# EAGLE design powerctl (EAGLE 7.7.0)
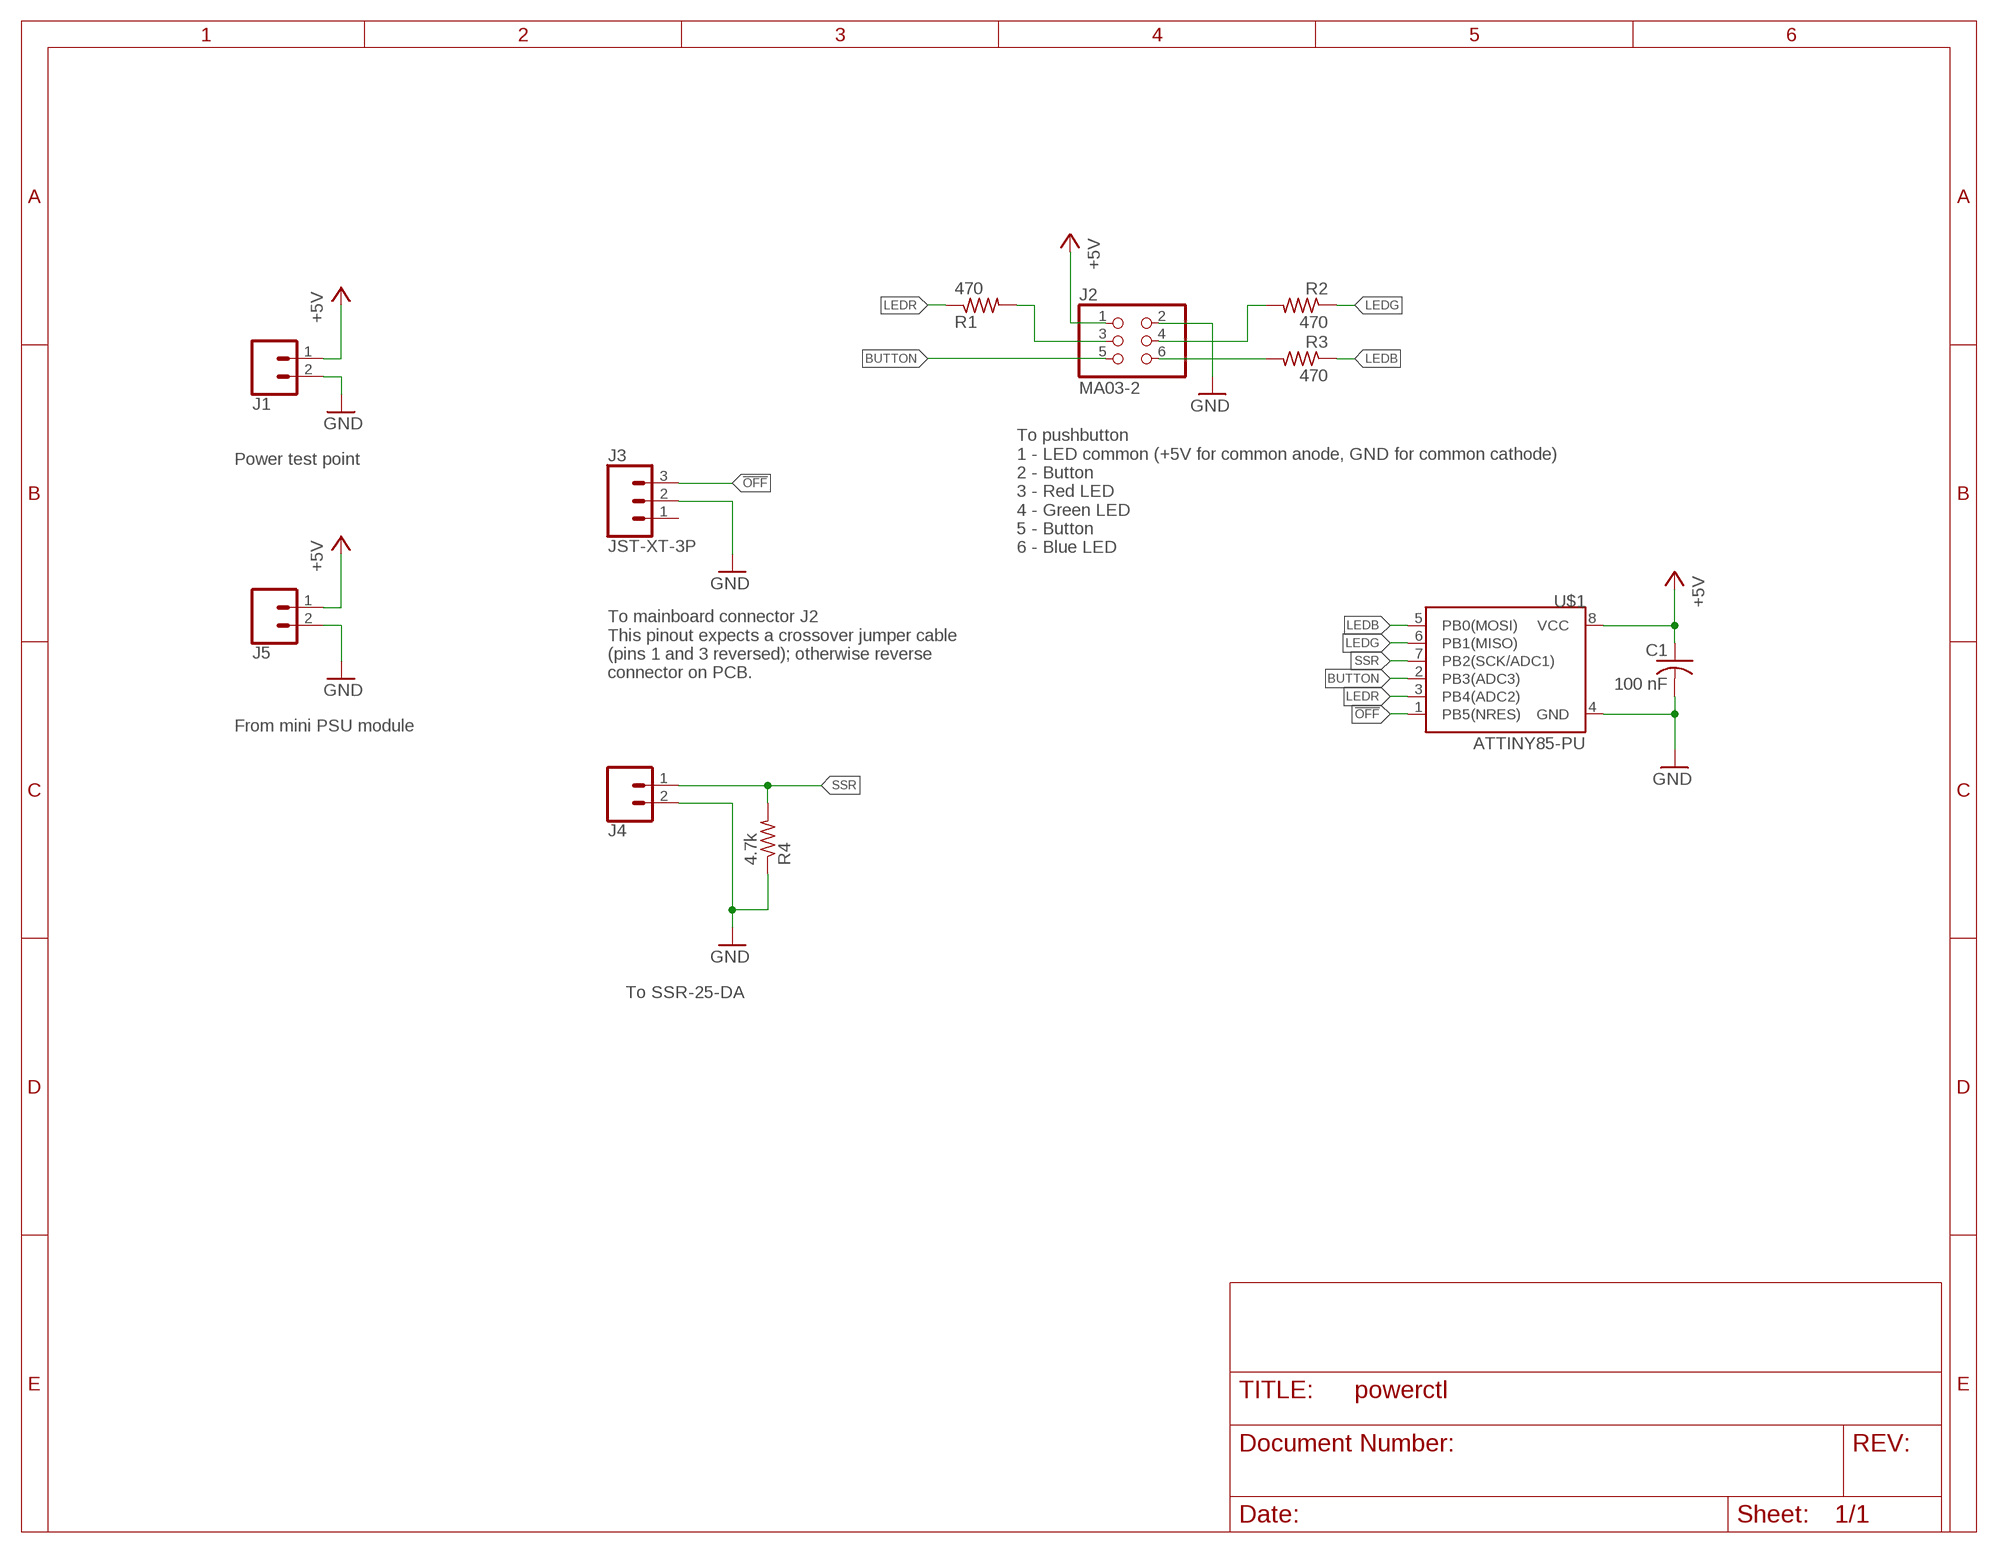
[diagram p0: schematic, sheet 1]

## Parts
C1  100 nF  C-US025-025X050  [C025-025X050]
J1  CONN_02  [1X02]
J2  MA03-2  PINHD-2X3  [2X03]
J3  JST-XT-3P  CONN_03  [1X03]
J4  CONN_02  [1X02]
J5  CONN_02  [1X02]
R1  470  R-US_0207/15  [0207/15]
R2  470  R-US_0207/15  [0207/15]
R3  470  R-US_0207/15  [0207/15]
R4  4.7k  R-US_0207/15  [0207/15]
U$1  ATTINY85-PU  ATTINY13DIP  [DIP08]

## Nets
!OFF: J3.3 U$1.1(PB5(NRES))
+5V [supply]: C1.1 J1.1 J2.1 J5.1 U$1.8(VCC)
BUTTON: J2.5 U$1.2(PB3(ADC3))
GND [supply]: C1.2 J1.2 J2.2 J3.2 J4.2 J5.2 R4.1 U$1.4(GND)
LEDB: R3.1 U$1.5(PB0(MOSI))
LEDG: R2.1 U$1.6(PB1(MISO))
LEDR: R1.1 U$1.3(PB4(ADC2))
N$1: J2.6 R3.2
N$2: J2.3 R1.2
N$3: J2.4 R2.2
SSR [supply]: J4.1 R4.2 U$1.7(PB2(SCK/ADC1))
Unconnected: J3.1

## Notes on the sheet
- Power test point
- To pushbutton
  1 - LED common (+5V for common anode, GND for common cathode)
  2 - Button
  3 - Red LED
  4 - Green LED
  5 - Button
  6 - Blue LED
- To mainboard connector J2
  This pinout expects a crossover jumper cable
  (pins 1 and 3 reversed); otherwise reverse
  connector on PCB.
- From mini PSU module
- To SSR-25-DA

## Library data of the parts
C1 = rcl:C-US: CAPACITOR, American symbol
J1 J4 J5 = SparkFun-Connectors:CONN_02: Multi connection point. Often used as Generic Header-pin footprint for 0.1 inch spaced/style header connections On any of the 0.1 inch spaced packages, you can populate with these: Break Away Headers - Straight <https://www.sparkfun.com/products/116> (PRT-00116) Break Away Male Headers - Right Angle <https://www.sparkfun.com/products/553> (PRT-00553) Female Headers <https://www.sparkfun.com/products/115> (PRT-00115) Break Away Headers - Machine Pin <https://www.sparkfun.com/products/117> (PRT-00117) Break Away Female Headers - Swiss Machine Pin <https://www.sparkfun.com/products/743> (PRT-00743) For SCREWTERMINALS and SPRING TERMINALS visit here: Screw Terimnals on SparkFun.com <https://www.sparkfun.com/search/results?term=Screw+Terminals> (5mm/3.5mm/2.54mm spacing) This device is also useful as a general connection point to wire up your design to another part of your project. Our various solder wires solder well into these plated through hole pads. Hook-Up Wire - Assortment (Stranded, 22 AWG) <https://www.sparkfun.com/products/11375> (PRT-11375) Hook-Up Wire - Assortment (Solid Core, 22 AWG) <https://www.sparkfun.com/products/11367> (PRT-11367) View the entire wire category on our website here <https://www.sparkfun.com/categories/141> Special notes: Molex polarized connector foot print use with: PRT-08233 with associated crimp pins and housings. 2.54_SCREWTERM for use with PRT-10571. 3.5mm Screw Terminal footprints for PRT-08084 5mm Screw Terminal footprints for use with PRT-08432
J2 = pinhead:PINHD-2X3: PIN HEADER
J3 = SparkFun-Connectors:CONN_03: Multi connection point. Often used as Generic Header-pin footprint for 0.1 inch spaced/style header connections On any of the 0.1 inch spaced packages, you can populate with these: Break Away Headers - Straight <https://www.sparkfun.com/products/116> (PRT-00116) Break Away Male Headers - Right Angle <https://www.sparkfun.com/products/553> (PRT-00553) Female Headers <https://www.sparkfun.com/products/115> (PRT-00115) Break Away Headers - Machine Pin <https://www.sparkfun.com/products/117> (PRT-00117) Break Away Female Headers - Swiss Machine Pin <https://www.sparkfun.com/products/743> (PRT-00743) Stackable Header - 3 Pin (Female, 0.1") <https://www.sparkfun.com/products/13875> (PRT-13875) For SCREWTERMINALS and SPRING TERMINALS visit here: Screw Terimnals on SparkFun.com <https://www.sparkfun.com/search/results?term=Screw+Terminals> (5mm/3.5mm/2.54mm spacing) This device is also useful as a general connection point to wire up your design to another part of your project. Our various solder wires solder well into these plated through hole pads. Hook-Up Wire - Assortment (Stranded, 22 AWG) <https://www.sparkfun.com/products/11375> (PRT-11375) Hook-Up Wire - Assortment (Solid Core, 22 AWG) <https://www.sparkfun.com/products/11367> (PRT-11367) View the entire wire category on our website here <https://www.sparkfun.com/categories/141> Special notes: Molex polarized connector foot print use with SKU : PRT-08232 with associated crimp pins and housings.; PROD_ID: XXX-00000; VALUE: 455-1750-1-ND
R1-R4 = rcl:R-US_: RESISTOR, American symbol
U$1 = SparkFun:ATTINY13

## Net classes
0 default: width 0.381 mm
1 supply: width 0.762 mm

## Board
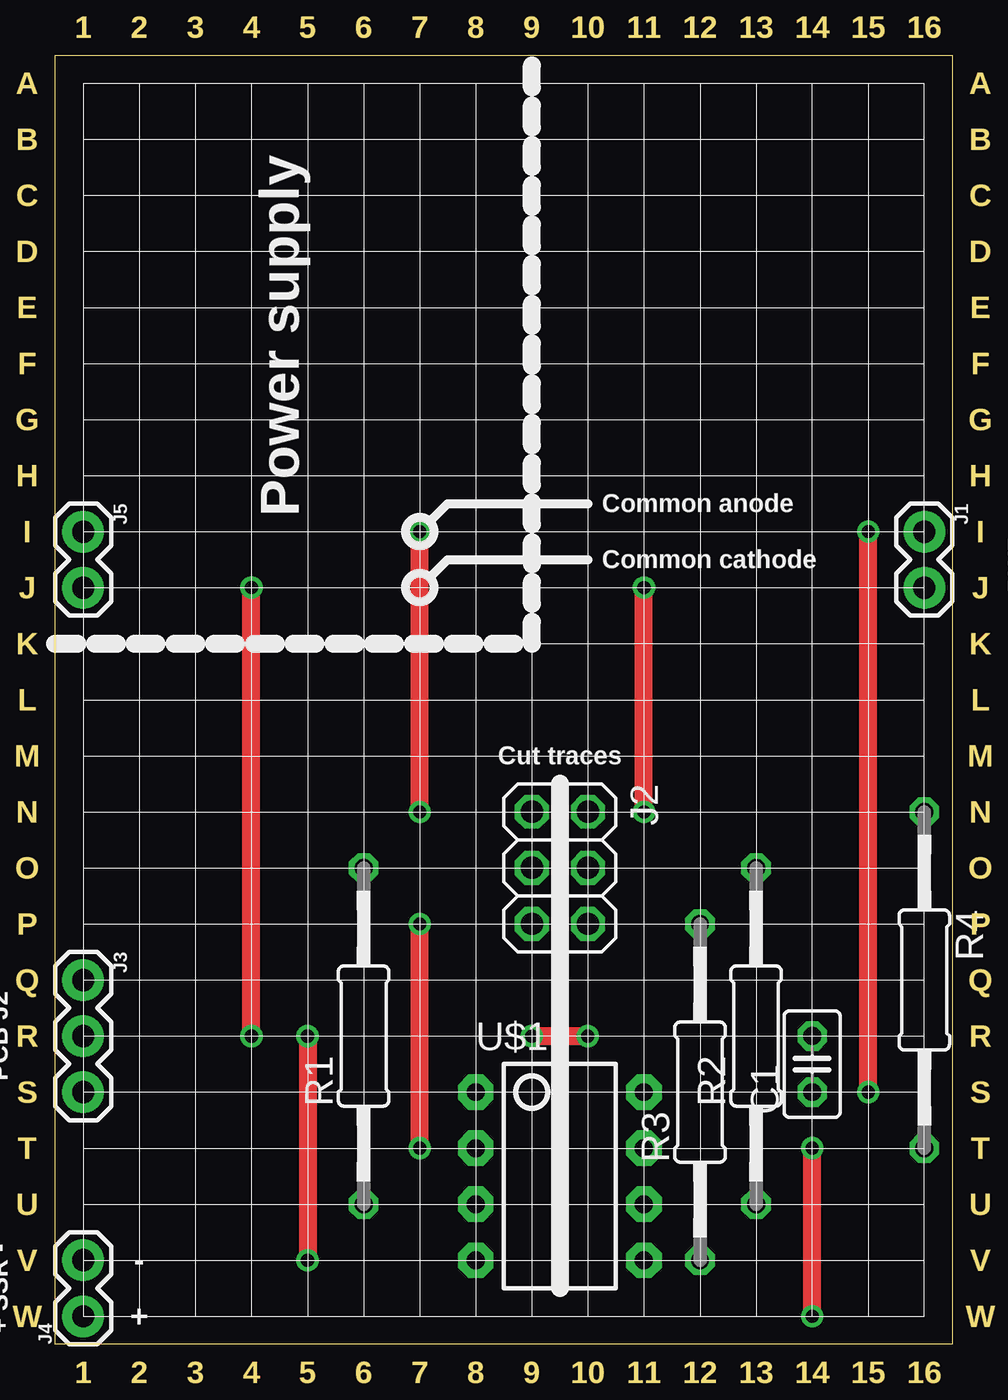
[diagram p1: board, top side]
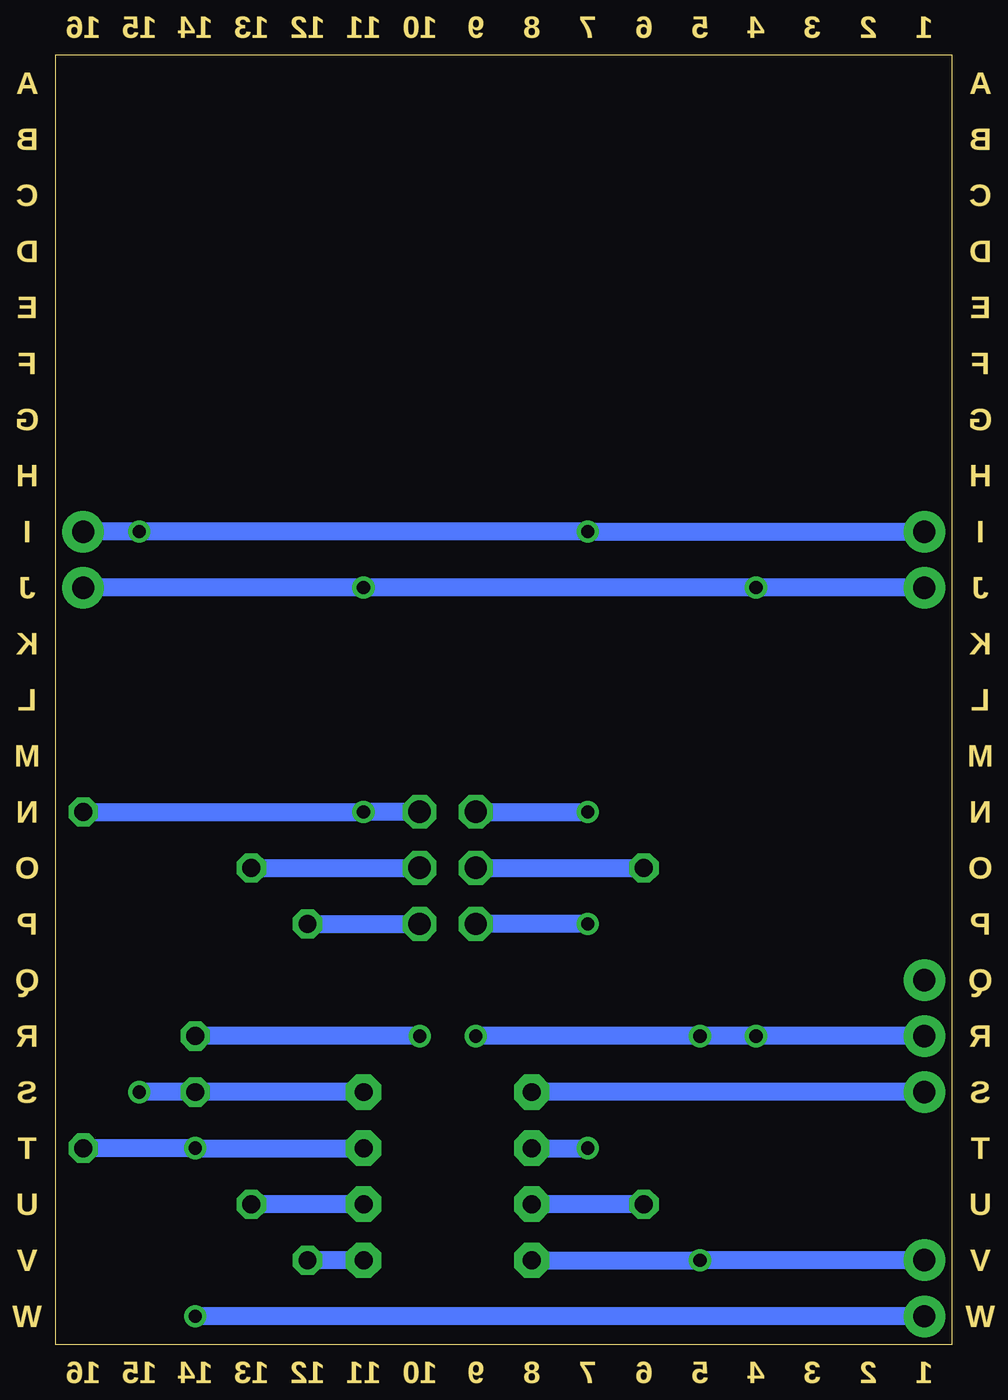
[diagram p2: board, bottom side, seen from below]

Size 40.64 x 58.42 mm. Coordinates in mm from the lower left corner, seen from the top.
Outline: 0,0 0,58.42 40.64,58.42 40.64,0 0,0
Copper layers (1*16): Top 0.035mm / dielectric 1.5mm / Bottom 0.035mm
Design rules "default": minimum track width 10mil, minimum drill 24mil, track to track 8mil, track to pad 8mil, pad to pad 8mil, via to via 8mil, smd to smd 8mil, copper to edge 40mil, drill to drill 8mil, minimum pad ring 10mil, minimum via ring 8mil, stop-mask expansion 4mil, vias tented up to drill 0mil, thermal gap 10mil
bKeepout: 1 lines

### Footprints (pad centres in the part's own frame; a part is rotated, then mirrored left to right if it is on the bottom)
C025-025X050 = drill 0.813 octagon: 1 -1.27,0; 2 1.27,0
1X02 = drill 1.016 pad 1.88: 1 0,0; 2 2.54,0
2X03 = drill 1.016 octagon: 1 -2.54,-1.27; 2 -2.54,1.27; 3 0,-1.27; 4 0,1.27; 5 2.54,-1.27; 6 2.54,1.27
1X03 = drill 1.016 pad 1.88: 1 0,0; 2 2.54,0; 3 5.08,0
0207/15 = drill 0.813 octagon: 1 -7.62,0; 2 7.62,0
DIP08 = drill 0.813 pad 1.6 octagon: 1 -3.81,-3.81; 2 -1.27,-3.81; 3 1.27,-3.81; 4 3.81,-3.81; 5 3.81,3.81; 6 1.27,3.81; 7 -1.27,3.81; 8 -3.81,3.81

### Placement (x,y rotation side)
C1  34.29,12.7 90 top
J1  39.37,36.83 270 top
J2  22.86,21.59 270 top
J3  1.27,16.51 270 top
J4  1.27,1.27 90 top
J5  1.27,36.83 270 top
R1  13.97,13.97 90 top
R2  31.75,13.97 90 top
R3  29.21,11.43 90 top
R4  39.37,16.51 270 top
U$1  22.86,7.62 270 top

### Tracks (layer width: path | path; a pad name or v marks a point on that pad's centre or on a via)
!OFF
  Bottom 0.813: J3.3 U$1.1
+5V  (via drill 0.6)
  Top 0.813: v16.51,24.13 v16.51,36.83 | v36.83,11.43 v36.83,36.83
  Bottom 0.813: C1.1 U$1.8 v36.83,11.43 | J2.1 v16.51,24.13 | J5.1 v16.51,36.83 v36.83,36.83 J1.1
BUTTON  (via drill 0.6)
  Top 0.813: v16.51,8.89 v16.51,19.05
  Bottom 0.813: U$1.2 v16.51,8.89 | v16.51,19.05 J2.5
GND  (via drill 0.6)
  Top 0.813: v11.43,13.97 v11.43,3.81 | v21.59,13.97 v24.13,13.97 | v26.67,24.13 v26.67,34.29 | v8.89,13.97 v8.89,34.29
  Bottom 0.813: J2.2 v26.67,24.13 R4.1 | J4.2 v11.43,3.81 U$1.4 | J3.2 v8.89,13.97 v11.43,13.97 v21.59,13.97 | v24.13,13.97 C1.2 | J1.2 v26.67,34.29 v8.89,34.29 J5.2
LEDB
  Bottom 0.813: U$1.5 R3.1
LEDG
  Bottom 0.813: U$1.6 R2.1
LEDR
  Bottom 0.813: R1.1 U$1.3
N$1
  Bottom 0.813: R3.2 J2.6
N$2
  Bottom 0.813: J2.3 R1.2
N$3
  Bottom 0.813: R2.2 J2.4
SSR  (via drill 0.6)
  Top 0.813: v34.29,1.27 v34.29,8.89
  Bottom 0.813: R4.2 v34.29,8.89 U$1.7 | J4.1 v34.29,1.27

### Text on the board
Dimension: 1 | 2 | 3 | 4 | 5 | 6 | 7 | 8 | 9 | 10 | 11 | 12 | 13 | 14 | 15 | 16 | A | A | B | B | C | C | D | D | E | E | F | F | G | G | H | H | I | I | J | J | K | K | L | L | M | M | N | N | O | O | P | P | Q | Q | R | R | S | S | T | T | U | U | V | V | W | W | 1 | 2 | 3 | 4 | 5 | 6 | 7 | 8 | 9 | 10 | 11 | 12 | 13 | 14 | 15 | 16
tPlace: Power supply | Common anode | Common cathode | - PWR + / For test | Cut traces | PCB J2 | - | + SSR - | + | Stripboard layout (traces blue, wires red)